# Altium schematic sheet RICK_TNY_00.SchDoc: Rick TNY
size A3; Date: 28/11/2023; DrawnBy: Wim Van Gool; DocumentNumber: 1; Revision: 00; SheetNumber: 1; SheetTotal: 1
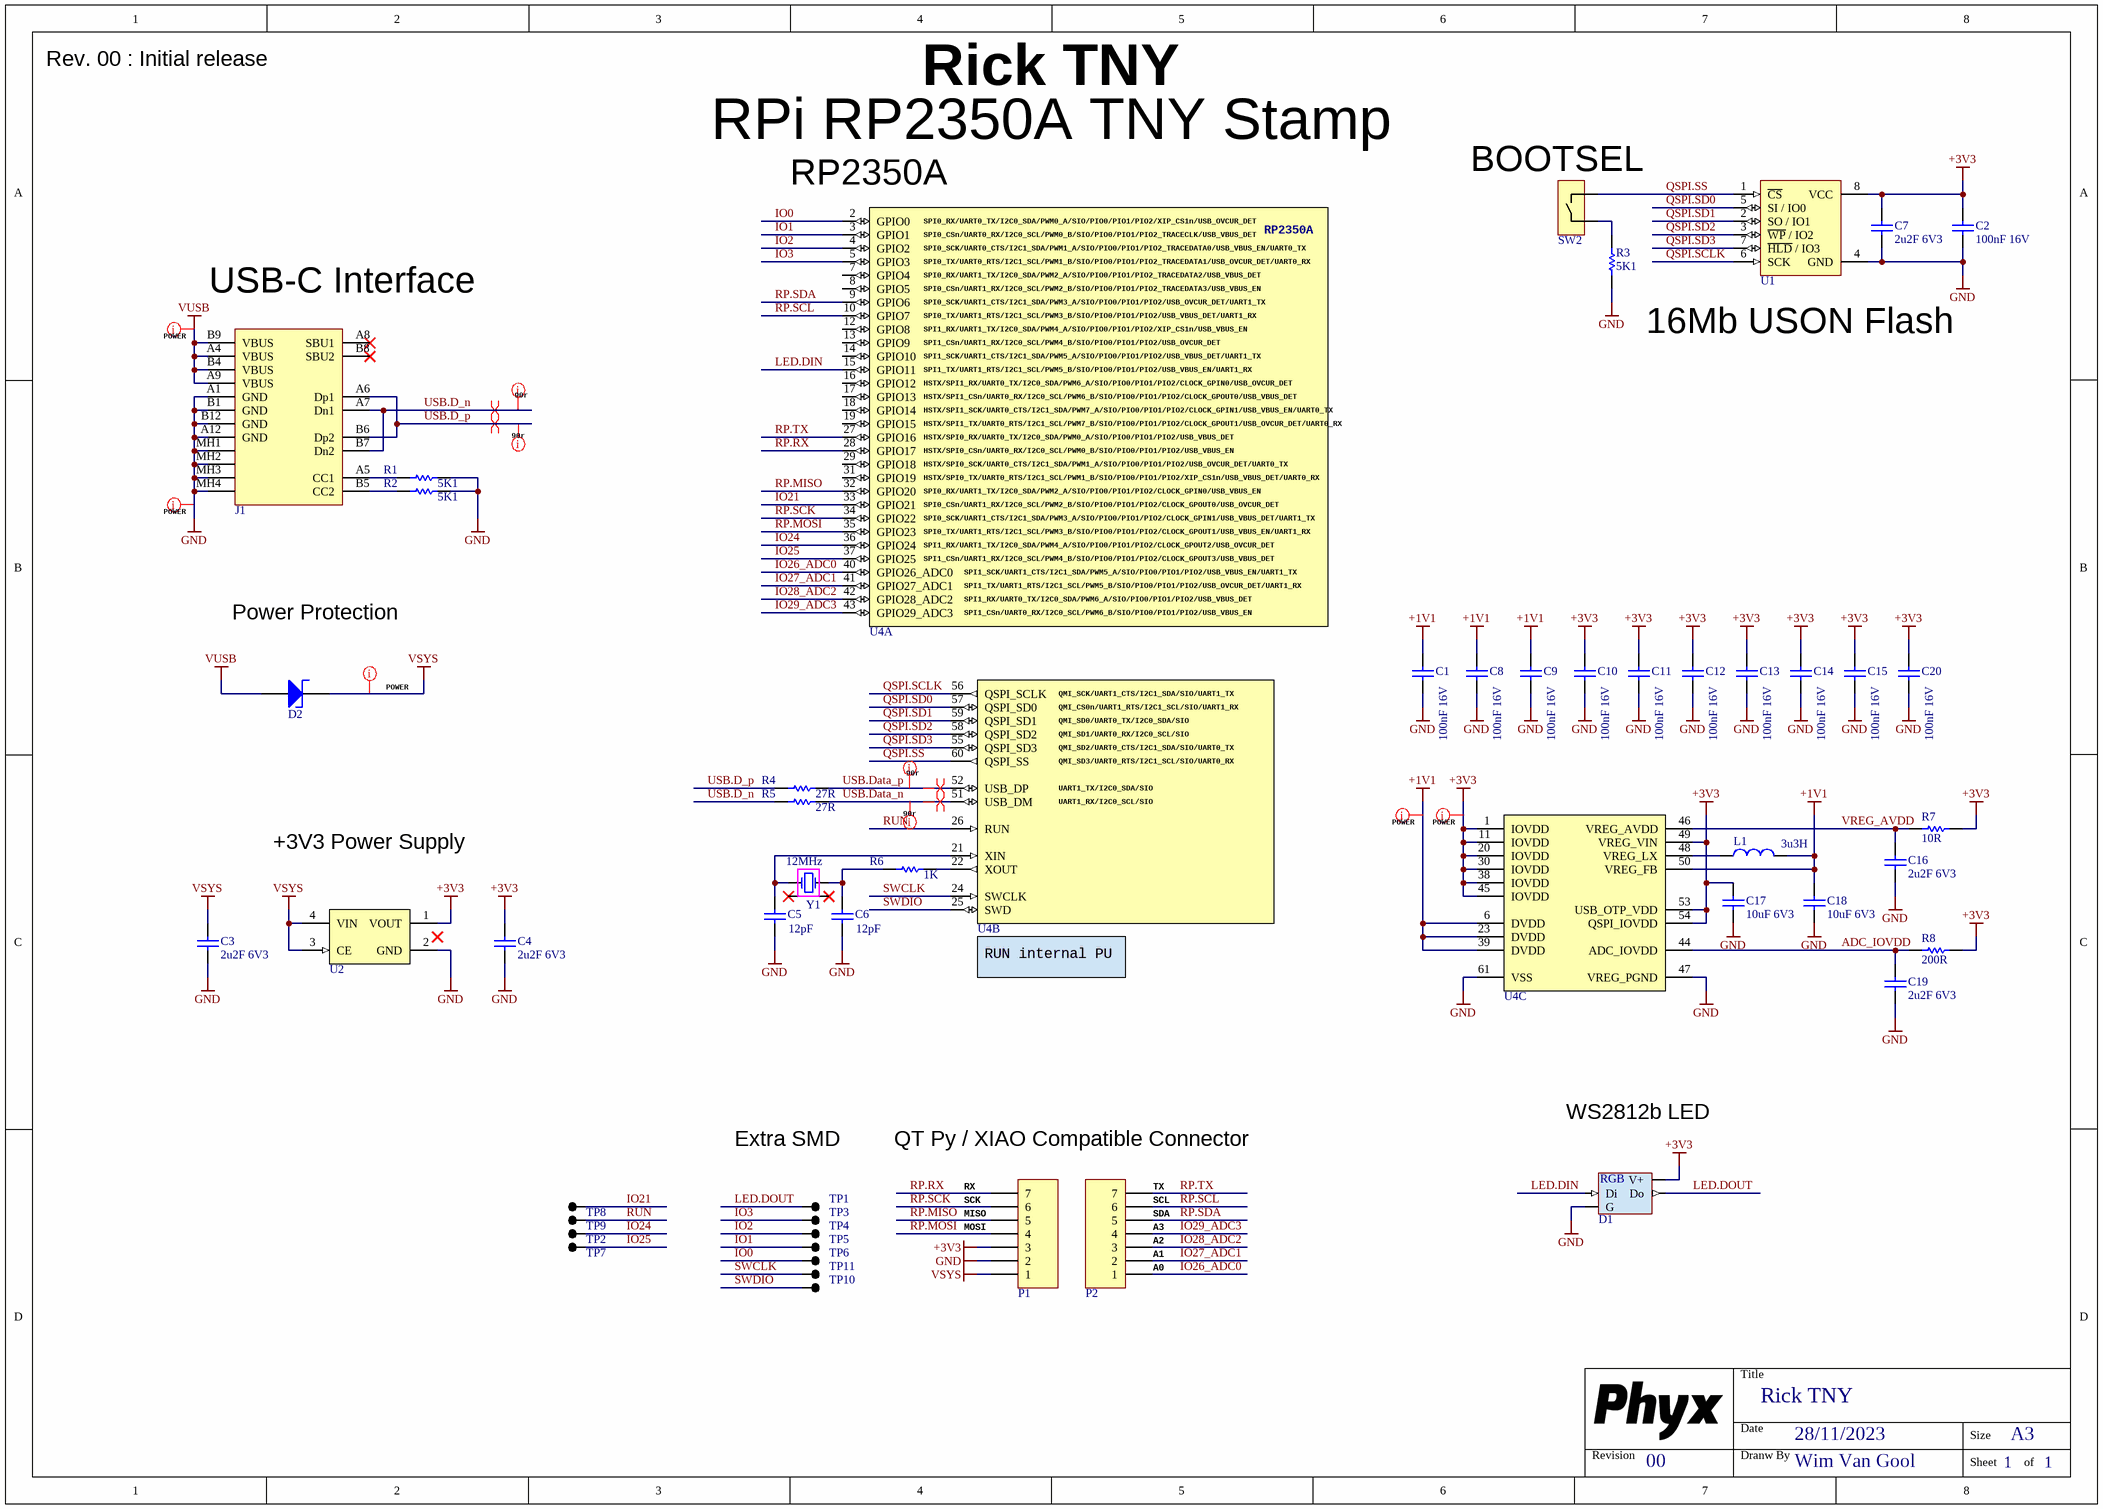
[diagram p0: RICK_TNY_00.SchDoc]

## Parts
C1  value 100nF 16V  [C0402]  (hidden comment: CAP_CERAMIC)
C2  value 100nF 16V  [C0402]  (hidden comment: CAP_CERAMIC)
C3  value 2u2F 6V3  [C0402]  (hidden comment: CAP_CERAMIC)
C4  value 2u2F 6V3  [C0402]  (hidden comment: CAP_CERAMIC)
C5  value 12pF  [C0402]  (hidden comment: CAP_CERAMIC)
C6  value 12pF  [C0402]  (hidden comment: CAP_CERAMIC)
C7  value 2u2F 6V3  [C0402]  (hidden comment: CAP_CERAMIC)
C8  value 100nF 16V  [C0402]  (hidden comment: CAP_CERAMIC)
C9  value 100nF 16V  [C0402]  (hidden comment: CAP_CERAMIC)
C10  value 100nF 16V  [C0402]  (hidden comment: CAP_CERAMIC)
C11  value 100nF 16V  [C0402]  (hidden comment: CAP_CERAMIC)
C12  value 100nF 16V  [C0402]  (hidden comment: CAP_CERAMIC)
C13  value 100nF 16V  [C0402]  (hidden comment: CAP_CERAMIC)
C14  value 100nF 16V  [C0402]  (hidden comment: CAP_CERAMIC)
C15  value 100nF 16V  [C0402]  (hidden comment: CAP_CERAMIC)
C16  value 2u2F 6V3  [C0402]  (hidden comment: CAP_CERAMIC)
C17  value 10uF 6V3  [C0402]  (hidden comment: CAP_CERAMIC)
C18  value 10uF 6V3  [C0402]  (hidden comment: CAP_CERAMIC)
C19  value 2u2F 6V3  [C0402]  (hidden comment: CAP_CERAMIC)
C20  value 100nF 16V  [C0402]  (hidden comment: CAP_CERAMIC)
D1  WS2812 based digital RGB LED 1010 package  [LED_1010_WS2812B]  (value not drawn)
D2  40V 1A 550mV@700mA 0603 Schottky  [ON_DSN2]  (value not drawn)
J1  USB 2.0 C Reversible Receptacle Horizontal full SMD  [XUNPU-TYPEC-304S-ACP16]  (value not drawn)
L1  value 3u3H  [L0805]  (hidden comment: LQM21PN3R3MGRD)
P1  Header 7  [HDR1X7]  (value not drawn)
P2  Header 7  [HDR1X7]  (value not drawn)
R1  value 5K1  [R0402]  (hidden comment: RESISTOR)
R2  value 5K1  [R0402]  (hidden comment: RESISTOR)
R3  value 5K1  [R0402]  (hidden comment: RESISTOR)
R4  value 27R  [R0402]  (hidden comment: RESISTOR)
R5  value 27R  [R0402]  (hidden comment: RESISTOR)
R6  value 1K  [R0402]  (hidden comment: RESISTOR)
R7  value 10R  [R0402]  (hidden comment: RESISTOR)
R8  value 200R  [R0402]  (hidden comment: RESISTOR)
SW2  TS24CA RA Tactile Switch 12V 50mA  [SHOU_HAN_TS24CA]  (value not drawn)
TP1  TEST_PAD  [TP_0.4mm]  (value not drawn)
TP2  TEST_PAD  [TP_0.4mm]  (value not drawn)
TP3  TEST_PAD  [TP_0.4mm]  (value not drawn)
TP4  TEST_PAD  [TP_0.4mm]  (value not drawn)
TP5  TEST_PAD  [TP_0.4mm]  (value not drawn)
TP6  TEST_PAD  [TP_0.4mm]  (value not drawn)
TP7  TEST_PAD  [TP_0.4mm]  (value not drawn)
TP8  TEST_PAD  [TP_0.4mm]  (value not drawn)
TP9  TEST_PAD  [TP_0.4mm]  (value not drawn)
TP10  TEST_PAD  [TP_0.4mm]  (value not drawn)
TP11  TEST_PAD  [TP_0.4mm]  (value not drawn)
U1  16Mb 3V3 133MHz SPI Flash DFN2x3 GD25Q16EEIGR  [USON_8_0.5_2x3]  (value not drawn)
U2  3V3 LDO 500mA 150mV  [DFNWB_1.0x1.0]  (value not drawn)
U4  RPi RP2350 QFN60 2xM33 ext Flash  [RPI_QFN60_0.4_7x7]  (value not drawn)  (parts A,B,C of 3)
Y1  value 12MHz  [XTAL_2520]  (hidden comment: 12MHz 2520 12pF ±10ppm ±30ppm)

## Nets
+1V1: C1.1 C8.1 C9.1 C18.1 L1.2 U4.6(DVDD) U4.23(DVDD) U4.39(DVDD) U4.50(VREG_FB)
+3V3: C2.1 C4.1 C7.1 C10.1 C11.1 C12.1 C13.1 C14.1 C15.1 C17.1 C20.1 D1.2(V+) P1.3 R7.1 R8.1 U1.8(VCC) U2.1(VOUT) U4.1(IOVDD) U4.11(IOVDD) U4.20(IOVDD) U4.30(IOVDD) U4.38(IOVDD) U4.45(IOVDD) U4.49(VREG_VIN) U4.53(USB_OTP_VDD) U4.54(QSPI_IOVDD)
GND: C1.2 C2.2 C3.2 C4.2 C5.2 C6.2 C7.2 C8.2 C9.2 C10.2 C11.2 C12.2 C13.2 C14.2 C15.2 C16.2 C17.2 C18.2 C19.2 C20.2 D1.3(G) J1.A1(GND) J1.A12(GND) J1.B1(GND) J1.B12(GND) J1.MH1(Tab) J1.MH2(Tab) J1.MH3(Tab) J1.MH4(Tab) P1.2 R1.1 R2.1 R3.2 U1.4(GND) U2.2(GND) U4.47(VREG_PGND) U4.61(VSS)
VSYS: C3.1 D2.C P1.1 U2.3(CE) U2.4(VIN)
VUSB: D2.A J1.A4(VBUS) J1.A9(VBUS) J1.B4(VBUS) J1.B9(VBUS)
ADC_IOVDD: C19.1 R8.2 U4.44(ADC_IOVDD)
IO0: TP6.1 U4.2(GPIO0)
IO1: TP5.1 U4.3(GPIO1)
IO2: TP4.1 U4.4(GPIO2)
IO3: TP3.1 U4.5(GPIO3)
IO21: TP8.1 U4.33(GPIO21)
IO24: TP2.1 U4.36(GPIO24)
IO25: TP7.1 U4.37(GPIO25)
IO26_ADC0: P2.1 U4.40(GPIO26_ADC0)
IO27_ADC1: P2.2 U4.41(GPIO27_ADC1)
IO28_ADC2: P2.3 U4.42(GPIO28_ADC2)
IO29_ADC3: P2.4 U4.43(GPIO29_ADC3)
LED.DIN: D1.4(Di) U4.15(GPIO11)
LED.DOUT: D1.1(Do) TP1.1
QSPI.SCLK: U1.6(SCK) U4.56(QSPI_SCLK)
QSPI.SD0: U1.5(SI_/_IO0) U4.57(QSPI_SD0)
QSPI.SD1: U1.2(SO_/_IO1) U4.59(QSPI_SD1)
QSPI.SD2: U1.3(~{WP}_/_IO2) U4.58(QSPI_SD2)
QSPI.SD3: U1.7(~{HLD}_/_IO3) U4.55(QSPI_SD3)
QSPI.SS: SW2.1 U1.1(~{CS}) U4.60(QSPI_SS)
RP.MISO: P1.5 U4.32(GPIO20)
RP.MOSI: P1.4 U4.35(GPIO23)
RP.RX: P1.7 U4.28(GPIO17)
RP.SCK: P1.6 U4.34(GPIO22)
RP.SCL: P2.6 U4.10(GPIO7)
RP.SDA: P2.5 U4.9(GPIO6)
RP.TX: P2.7 U4.27(GPIO16)
RUN: TP9.1 U4.26(RUN)
SWCLK: TP11.1 U4.24(SWCLK)
SWDIO: TP10.1 U4.25(SWD)
USB.D_n: J1.A7(Dn1) J1.B7(Dn2) R5.2
USB.D_p: J1.A6(Dp1) J1.B6(Dp2) R4.2
USB.Data_n: R5.1 U4.51(USB_DM)
USB.Data_p: R4.1 U4.52(USB_DP)
VREG_AVDD: C16.1 R7.2 U4.46(VREG_AVDD)
NetC5_1: C5.1 U4.21(XIN) Y1.1(OSC1)
NetC6_1: C6.1 R6.1 Y1.3(OSC3)
NetJ1_A5: J1.A5(CC1) R1.2
NetJ1_B5: J1.B5(CC2) R2.2
NetL1_1: L1.1 U4.48(VREG_LX)
NetR3_1: R3.1 SW2.2
NetR6_2: R6.2 U4.22(XOUT)

Not connected (* = marked no-connect by the designer): J1 A8(SBU1)* B8(SBU2)*; U4 7(GPIO4) 8(GPIO5) 12(GPIO8) 13(GPIO9) 14(GPIO10) 16(GPIO12) 17(GPIO13) 18(GPIO14) 19(GPIO15) 29(GPIO18) 31(GPIO19); Y1 2(GND1)* 4(GND2)*

## Layout directives
net class 90r: USB.D_n, USB.D_p, USB.Data_n, USB.Data_p
differential pair: USB.D_n, USB.D_p, USB.Data_n, USB.Data_p
net class POWER: +1V1, +3V3, GND, VSYS, VUSB

## Notes on the sheet
- Rev. 00 : Initial release
- RPi RP2350A TNY Stamp
- (near SW2) BOOTSEL
- (near U4) RP2350A
- (near J1) USB-C Interface
- 16Mb USON Flash
- Power Protection
- +3V3 Power Supply
- (near U4) RUN internal PU
- WS2812b LED
- Extra SMD
- (near P1) RX
- QT Py / XIAO Compatible Connector
- (near P2) TX
- (near P1) MOSI
- (near P1) MISO
- (near P1) SCK
- (near P2) SCL
- (near P2) SDA
- (near P2) A1
- (near P2) A2
- (near P2) A3
- (near P2) A0
- Title
- Revision
- Date
- Dranw By
- Size
- Sheet
- of
- (in symbol LED # RGB XL-1010RGBC-WS2812B) RGB
- (in symbol M33 # RP2350A, part A) SPI0_RX/UART0_TX/I2C0_SDA/PWM0_A/SIO/PIO0/PIO1/PIO2/XIP_CS1n/USB_OVCUR_DET; SPI0_CSn/UART0_RX/I2C0_SCL/PWM0_B/SIO/PIO0/PIO1/PIO2_TRACECLK/USB_VBUS_DET; SPI0_SCK/UART0_CTS/I2C1_SDA/PWM1_A/SIO/PIO0/PIO1/PIO2_TRACEDATA0/USB_VBUS_EN/UART0_TX; SPI0_TX/UART0_RTS/I2C1_SCL/PWM1_B/SIO/PIO0/PIO1/PIO2_TRACEDATA1/USB_OVCUR_DET/UART0_RX; SPI0_RX/UART1_TX/I2C0_SDA/PWM2_A/SIO/PIO0/PIO1/PIO2_TRACEDATA2/USB_VBUS_DET; SPI0_CSn/UART1_RX/I2C0_SCL/PWM2_B/SIO/PIO0/PIO1/PIO2_TRACEDATA3/USB_VBUS_EN; SPI0_SCK/UART1_CTS/I2C1_SDA/PWM3_A/SIO/PIO0/PIO1/PIO2/USB_OVCUR_DET/UART1_TX; SPI0_TX/UART1_RTS/I2C1_SCL/PWM3_B/SIO/PIO0/PIO1/PIO2/USB_VBUS_DET/UART1_RX; SPI1_RX/UART1_TX/I2C0_SDA/PWM4_A/SIO/PIO0/PIO1/PIO2/XIP_CS1n/USB_VBUS_EN; SPI1_CSn/UART1_RX/I2C0_SCL/PWM4_B/SIO/PIO0/PIO1/PIO2/USB_OVCUR_DET; SPI1_SCK/UART1_CTS/I2C1_SDA/PWM5_A/SIO/PIO0/PIO1/PIO2/USB_VBUS_DET/UART1_TX; SPI1_TX/UART1_RTS/I2C1_SCL/PWM5_B/SIO/PIO0/PIO1/PIO2/USB_VBUS_EN/UART1_RX; HSTX/SPI1_RX/UART0_TX/I2C0_SDA/PWM6_A/SIO/PIO0/PIO1/PIO2/CLOCK_GPIN0/USB_OVCUR_DET; HSTX/SPI1_CSn/UART0_RX/I2C0_SCL/PWM6_B/SIO/PIO0/PIO1/PIO2/CLOCK_GPOUT0/USB_VBUS_DET; HSTX/SPI1_SCK/UART0_CTS/I2C1_SDA/PWM7_A/SIO/PIO0/PIO1/PIO2/CLOCK_GPIN1/USB_VBUS_EN/UART0_TX; HSTX/SPI1_TX/UART0_RTS/I2C1_SCL/PWM7_B/SIO/PIO0/PIO1/PIO2/CLOCK_GPOUT1/USB_OVCUR_DET/UART0_RX; HSTX/SPI0_RX/UART0_TX/I2C0_SDA/PWM0_A/SIO/PIO0/PIO1/PIO2/USB_VBUS_DET; HSTX/SPI0_CSn/UART0_RX/I2C0_SCL/PWM0_B/SIO/PIO0/PIO1/PIO2/USB_VBUS_EN; HSTX/SPI0_SCK/UART0_CTS/I2C1_SDA/PWM1_A/SIO/PIO0/PIO1/PIO2/USB_OVCUR_DET/UART0_TX; HSTX/SPI0_TX/UART0_RTS/I2C1_SCL/PWM1_B/SIO/PIO0/PIO1/PIO2/XIP_CS1n/USB_VBUS_DET/UART0_RX; SPI0_RX/UART1_TX/I2C0_SDA/PWM2_A/SIO/PIO0/PIO1/PIO2/CLOCK_GPIN0/USB_VBUS_EN; SPI0_CSn/UART1_RX/I2C0_SCL/PWM2_B/SIO/PIO0/PIO1/PIO2/CLOCK_GPOUT0/USB_OVCUR_DET; SPI0_SCK/UART1_CTS/I2C1_SDA/PWM3_A/SIO/PIO0/PIO1/PIO2/CLOCK_GPIN1/USB_VBUS_DET/UART1_TX; SPI0_TX/UART1_RTS/I2C1_SCL/PWM3_B/SIO/PIO0/PIO1/PIO2/CLOCK_GPOUT1/USB_VBUS_EN/UART1_RX; SPI1_RX/UART1_TX/I2C0_SDA/PWM4_A/SIO/PIO0/PIO1/PIO2/CLOCK_GPOUT2/USB_OVCUR_DET; SPI1_CSn/UART1_RX/I2C0_SCL/PWM4_B/SIO/PIO0/PIO1/PIO2/CLOCK_GPOUT3/USB_VBUS_DET; SPI1_SCK/UART1_CTS/I2C1_SDA/PWM5_A/SIO/PIO0/PIO1/PIO2/USB_VBUS_EN/UART1_TX; SPI1_TX/UART1_RTS/I2C1_SCL/PWM5_B/SIO/PIO0/PIO1/PIO2/USB_OVCUR_DET/UART1_RX; SPI1_RX/UART0_TX/I2C0_SDA/PWM6_A/SIO/PIO0/PIO1/PIO2/USB_VBUS_DET; SPI1_CSn/UART0_RX/I2C0_SCL/PWM6_B/SIO/PIO0/PIO1/PIO2/USB_VBUS_EN
- (in symbol M33 # RP2350A, part B) QMI_SCK/UART1_CTS/I2C1_SDA/SIO/UART1_TX; QMI_CS0n/UART1_RTS/I2C1_SCL/SIO/UART1_RX; QMI_SD0/UART0_TX/I2C0_SDA/SIO; QMI_SD1/UART0_RX/I2C0_SCL/SIO; QMI_SD2/UART0_CTS/I2C1_SDA/SIO/UART0_TX; QMI_SD3/UART0_RTS/I2C1_SCL/SIO/UART0_RX; UART1_TX/I2C0_SDA/SIO; UART1_RX/I2C0_SCL/SIO

## Library data of the parts
C1 C2 C8-C15 C20 = CAP # 100nF 16V 0402: Capacitor Ceramic; Supplier 1: Farnell; Supplier Part Number 1: 1758896; Supplier 3: Generic; Supplier Part Number 3: 100nF 16V 0402 X7R
C3 C4 C7 C16 C19 = CAP # 2u2F 6V3 0402: Capacitor Ceramic; Supplier 1: LCSC; Supplier Part Number 1: C12530; Supplier 3: Generic; Supplier Part Number 3: 2u2F 6V3 0402 X5R
C5 C6 = CAP # 12pF 50V 0402: Capacitor Ceramic; Supplier 1: Farnell; Supplier Part Number 1: 2310489; Supplier 3: Generic; Supplier Part Number 3: 12pF 0402; Description: CAP # 12pF 50V 0402; Supplier 2: LCSC; Supplier Part Number 2: C106201
C17 C18 = CAP # 10uF 6V3 0402: Capacitor Ceramic; Supplier 1: LCSC; Supplier Part Number 1: C15525; Supplier 2: LCSC; Supplier Part Number 2: C87148; Supplier 3: Generic; Supplier Part Number 3: 10uF 6V3 0402 X5R
D1 = LED # RGB XL-1010RGBC-WS2812B: =Description; Value: XL-1010RGBC-WS2812B; Supplier 1: LCSC; Supplier Part Number 1: C5349953
D2 = Schottky # CDBVRL140-HF: =Description; Value: CDBVRL140-HF; Supplier 1: LCSC; Supplier Part Number 1: C3758192; Supplier 2: LCSC; Supplier Part Number 2: C153761
J1 = USB # C 2.0 RCPT TYPEC-304S-ACP16: Value: TYPEC-304S-ACP16; Supplier 1: LCSC; Supplier Part Number 1: C720630
L1 = IND # 3u3H 0603 1A: Supplier 1: LCSC; Supplier Part Number 1: C162585
P1 P2 = Pin Header 2.54mm 7way
R1-R3 = RES # 5K1 0402: Supplier 1: LCSC; Supplier Part Number 1: C274895; Supplier 3: Generic; Supplier Part Number 3: 5K1 1% 0402
R4 R5 = RES # 27R 0402: Supplier 3: Generic; Supplier Part Number 3: 27R 1% 0402
R6 = RES # 1K 0402: Supplier 3: Generic; Supplier Part Number 3: 1K 1% 0402
R7 = RES # 10R 0402: Supplier 1: LCSC; Supplier Part Number 1: C2906862; Supplier 2: LCSC; Supplier Part Number 2: C138066; Supplier 3: Generic; Supplier Part Number 3: 10R 1% 0402
R8 = RES # 200R 0402: Supplier 1: LCSC; Supplier Part Number 1: C2909333; Supplier 2: LCSC; Supplier Part Number 2: C114764; Supplier 3: Generic; Supplier Part Number 3: 200R 1% 0402
SW2 = SW # TACT RA TS24CA: Value: TS24CA; Supplier 1: LCSC; Supplier Part Number 1: C393942
TP1-TP11 = TP # 0.4mm: Value: NO BOM; Supplier 1: XXX; Supplier Part Number 1: FOOTPRINT ONLY
U1 = FLSH # 16Mb QSPI NOR 3V3 133MHz DFN GD25Q16EEIGR: Value: GD25Q16EEIGR; Supplier 1: LCSC; Supplier Part Number 1: C2986331
U2 = LDO # 3V3 500mA CJ6205B33F: =Designator; Value: CJ6205B33F; Supplier 1: LCSC; Supplier Part Number 1: C2829397
U4 = M33 # RP2350A: =Description; Value: RP2350A
Y1 = XTAL # 12Mhz 2520 12pF: Crystal Oscillator 4pin casing; Supplier 1: LCSC; Supplier Part Number 1: C7294611